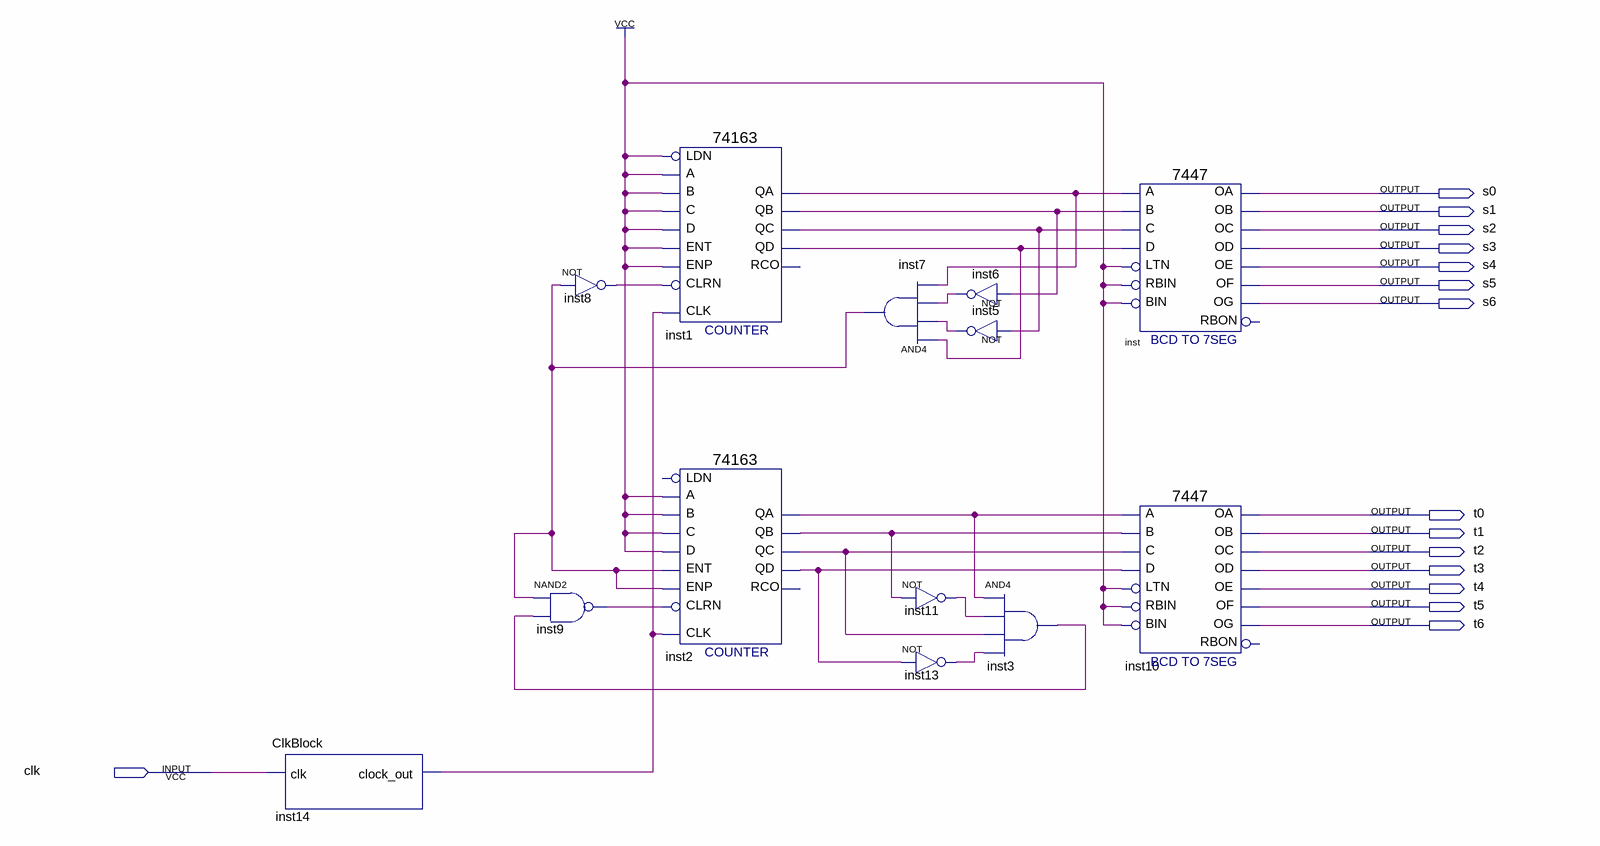
[diagram p0: schematic sheet]
// Quartus schematic bonus.bdf as structural Verilog: 13 symbols, 15 pins
module bonus (
  input  clk,
  output s0,
  output s1,
  output s2,
  output s3,
  output s4,
  output s5,
  output s6,
  output t0,
  output t1,
  output t2,
  output t3,
  output t4,
  output t5,
  output t6
);

  wire inst1_qa, inst1_qb, inst1_qc, inst1_qd, inst2_qa, inst2_qb, inst2_qc, inst2_qd, inst3_out, inst5_out,
       inst6_out, inst7_out, inst8_out, inst9_out, inst11_out, inst13_out, inst14_clock_out;

  ClkBlock inst14 (.clk(clk), .clock_out(inst14_clock_out));
  not inst8 (inst8_out, inst7_out);
  nand inst9 (inst9_out, inst7_out, inst3_out);
  \74163  inst1 (
    .C(1'b1), .B(1'b1), .A(1'b1), .ENT(1'b1), .D(1'b1), .CLRN(inst8_out), .CLK(inst14_clock_out), .ENP(1'b1),
    .LDN(1'b1), .QA(inst1_qa), .QB(inst1_qb), .QC(inst1_qc), .QD(inst1_qd));  // open: RCO
  \74163  inst2 (
    .C(1'b1), .B(1'b1), .A(1'b1), .ENT(inst7_out), .D(1'b1), .CLRN(inst9_out), .CLK(inst14_clock_out),
    .ENP(inst7_out), .QA(inst2_qa), .QB(inst2_qb), .QC(inst2_qc), .QD(inst2_qd));  // open: LDN, RCO
  and inst7 (inst7_out, inst1_qd, inst5_out, inst6_out, inst1_qa);
  not inst6 (inst6_out, inst1_qb);
  not inst5 (inst5_out, inst1_qc);
  not inst11 (inst11_out, inst2_qb);
  not inst13 (inst13_out, inst2_qd);
  and inst3 (inst3_out, inst2_qa, inst11_out, inst2_qc, inst13_out);
  \7447  inst (
    .LTN(1'b1), .B(inst1_qb), .C(inst1_qc), .D(inst1_qd), .RBIN(1'b1), .BIN(1'b1), .A(inst1_qa), .OB(s1),
    .OC(s2), .OE(s4), .OD(s3), .OF(s5), .OG(s6), .OA(s0));  // open: RBON
  \7447  inst10 (
    .LTN(1'b1), .B(inst2_qb), .C(inst2_qc), .D(inst2_qd), .RBIN(1'b1), .BIN(1'b1), .A(inst2_qa), .OB(t1),
    .OC(t2), .OE(t4), .OD(t3), .OF(t5), .OG(t6), .OA(t0));  // open: RBON
endmodule
